# Altium schematic sheet 集成板.SchDoc
size A4; SheetNumber: 1; SheetTotal: 1
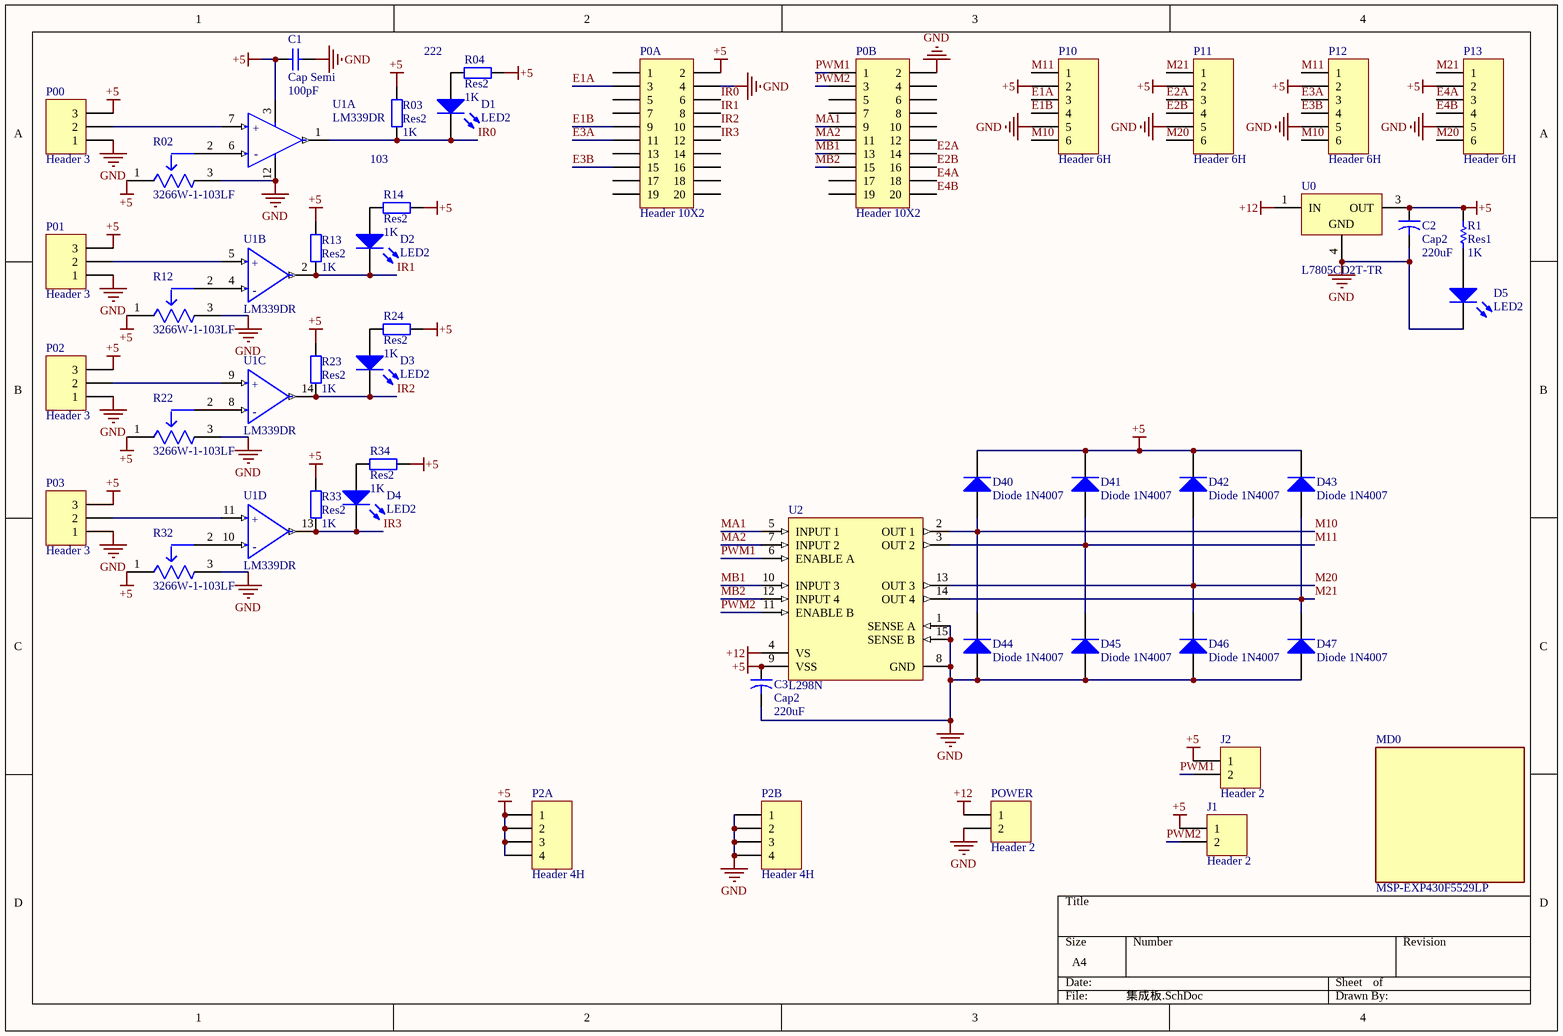
[diagram p0: 集成板.SchDoc]

## Parts
C1  Cap Semi  value 100pF  [C1206]
C2  Cap2  value 220uF  [CAPR5-4X5]
C3  Cap2  value 220uF  [CAPR5-4X5]
D1  LED2  [3.2X1.6X1.1]
D2  LED2  [3.2X1.6X1.1]
D3  LED2  [3.2X1.6X1.1]
D4  LED2  [3.2X1.6X1.1]
D5  LED2  [3.2X1.6X1.1]
D40  Diode 1N4007  [DO-41]
D41  Diode 1N4007  [DO-41]
D42  Diode 1N4007  [DO-41]
D43  Diode 1N4007  [DO-41]
D44  Diode 1N4007  [DO-41]
D45  Diode 1N4007  [DO-41]
D46  Diode 1N4007  [DO-41]
D47  Diode 1N4007  [DO-41]
J1  Header 2  [HDR1X2]
J2  Header 2  [HDR1X2]
MD0  MSP-EXP430F5529LP  [FP-MSP-EXP430F5529LP-MFG]
P00  Header 3  [HDR1X3]
P0A  Header 10X2  [HDR2X10]
P0B  Header 10X2  [HDR2X10]
P01  Header 3  [HDR1X3]
P02  Header 3  [HDR1X3]
P2A  Header 4H  [HDR1X4H]
P2B  Header 4H  [HDR1X4H]
P03  Header 3  [HDR1X3]
P10  Header 6H  [HDR1X6H]
P11  Header 6H  [HDR1X6H]
P12  Header 6H  [HDR1X6H]
P13  Header 6H  [HDR1X6H]
POWER  Header 2  [HDR1X2]
R1  Res1  value 1K  [AXIAL-0.3]
R02  3266W-1-103LF  [FP-3266W-MFG]
R03  Res2  value 1K  [C1206]
R04  Res2  value 1K  [C1206]
R12  3266W-1-103LF  [FP-3266W-MFG]
R13  Res2  value 1K  [C1206]
R14  Res2  value 1K  [C1206]
R22  3266W-1-103LF  [FP-3266W-MFG]
R23  Res2  value 1K  [C1206]
R24  Res2  value 1K  [C1206]
R32  3266W-1-103LF  [FP-3266W-MFG]
R33  Res2  value 1K  [C1206]
R34  Res2  value 1K  [C1206]
U0  L7805CD2T-TR  [TO-263_M]
U1  LM339DR  [FP-D0014A-MFG]  (parts A,B,C,D of 4)
U2  L298N  [STM-FM-15]

## Nets
+5: C1.1 C2.1 C3.1 D40.2(K) D41.2(K) D42.2(K) D43.2(K) J1.1 J2.1 P00.3 P0A.2 P01.3 P02.3 P2A.1 P2A.2 P2A.3 P2A.4 P03.3 P10.2 P11.2 P12.2 P13.2 R1.2 R02.1(CCW) R03.2 R04.1 R12.1(CCW) R13.2 R14.2 R22.1(CCW) R23.1 R24.2 R32.1(CCW) R33.2 R34.2 U0.3(OUT) U1.3(VCC) U2.9(VSS)
+12: POWER.1 U0.1(IN) U2.4(VS)
GND: C1.2 C2.2 C3.2 D5.2(K) D44.1(A) D45.1(A) D46.1(A) D47.1(A) P00.1 P0A.4 P0B.2 P01.1 P02.1 P2B.1 P2B.2 P2B.3 P2B.4 P03.1 P10.5 P11.5 P12.5 P13.5 POWER.2 R02.3(CW) R12.3(CW) R22.3(CW) R32.3(CW) U0.4(GND) U1.12(GND) U2.1(SENSE_A) U2.8(GND) U2.15(SENSE_B)
E1A: P0A.3 P10.3
E1B: P0A.9 P10.4
E2A: P0B.14 P11.3
E2B: P0B.16 P11.4
E3A: P0A.11 P12.3
E3B: P0A.15 P12.4
E4A: P0B.18 P13.3
E4B: P0B.20 P13.4
IR0: D1.2(K) P0A.6 R03.1 U1.1(1OUT)
IR1: D2.2(K) P0A.8 R13.1 U1.2(2OUT)
IR2: D3.2(K) P0A.10 R23.2 U1.14(OUT3)
IR3: D4.2(K) P0A.12 R33.1 U1.13(OUT4)
M10: D40.1(A) D44.2(K) P10.6 P12.6 U2.2(OUT_1)
M11: D41.1(A) D45.2(K) P10.1 P12.1 U2.3(OUT_2)
M20: D42.1(A) D46.2(K) P11.6 P13.6 U2.13(OUT_3)
M21: D43.1(A) D47.2(K) P11.1 P13.1 U2.14(OUT_4)
MA1: P0B.9 U2.5(INPUT_1)
MA2: P0B.11 U2.7(INPUT_2)
MB1: P0B.13 U2.10(INPUT_3)
MB2: P0B.15 U2.12(INPUT_4)
PWM1: J2.2 P0B.1 U2.6(ENABLE_A)
PWM2: J1.2 P0B.3 U2.11(ENABLE_B)
NetD1_1: D1.1(A) R04.2
NetD2_1: D2.1(A) R14.1
NetD3_1: D3.1(A) R24.1
NetD4_1: D4.1(A) R34.1
NetD5_1: D5.1(A) R1.1
NetP00_2: P00.2 U1.7(1IN+)
NetP01_2: P01.2 U1.5(2IN+)
NetP02_2: P02.2 U1.9(3IN+)
NetP03_2: P03.2 U1.11(4IN+)
NetR02_2: R02.2(WIPER) U1.6(1IN-)
NetR12_2: R12.2(WIPER) U1.4(2IN-)
NetR22_2: R22.2(WIPER) U1.8(3IN-)
NetR32_2: R32.2(WIPER) U1.10(4IN-)

Not connected (* = marked no-connect by the designer): P0A 1 5 7 13 14 16 17 18 19 20; P0B 4 5 6 7 8 10 12 17 19

## Notes on the sheet
- 222
- 103
- (in symbol CMP-04896-000028-1, part A) +; -
- (in symbol CMP-04896-000028-1, part B) +; -
- (in symbol CMP-04896-000028-1, part C) +; -
- (in symbol CMP-04896-000028-1, part D) +; -

## Library data of the parts
C1 = Cap Semi: Capacitor (Semiconductor SIM Model); Published: 8-Jun-2000; LatestRevisionDate: 29-May-2009; LatestRevisionNote: IPC-7351 Footprint Added.; PackageReference: C1206; Publisher: Altium Limited; PackageDescription: Chip Capacitor
C2 C3 = Cap2: Capacitor; Published: 23-Sep-2002; PackageReference: CAPR5-4X5; Publisher: Altium Limited; PackageDescription: Capacitor; 2 Leads
D1-D5 = LED2: Typical RED, GREEN, YELLOW, AMBER GaAs LED; Published: 8-Jun-2000; LatestRevisionDate: 17-Jul-2002; LatestRevisionNote: Re-released for DXP Platform.; PackageVersion: Feb-2002; PackageReference: 3.2X1.6X1.1; Publisher: Altium Limited; PackageDescription: SM LED; 2 Flat Leads
D40-D47 = Diode 1N4007: 1 Amp General Purpose Rectifier; Published: 8-Jun-2000; LatestRevisionDate: 17-Jul-2002; LatestRevisionNote: Re-released for DXP Platform.; DatasheetVersion: 1998; PackageVersion: Aug-1999; PackageReference: DO-41; Publisher: Altium Limited; PackageDescription: Diode, Axial; Body 5.2 x 2.7 mm (LxDia. max), Lead Dia. 0.86 mm (max); Code_JEDEC: DO-204-AL; ComponentLink1Description: Manufacturer Link; ComponentLink1URL: http://www.fairchildsemi.com/; ComponentLink2Description: Datasheet; ComponentLink2URL: http://www.fairchildsemi.com/ds/1N%2F1N4001.pdf
J1 J2 POWER = Header 2: Header, 2-Pin; LatestRevisionDate: 17-Jul-2002; LatestRevisionNote: Re-released for DXP Platform.; Publisher: Altium Limited
MD0 = CMP-04865-000002-1: LAUNCHPAD MSP430F5529 EVAL BRD; Manufacturer: Texas Instruments; Max Supply Voltage: 5V; Memory Size: 128KBytes; Memory Type: FLASH; Number Of I/Os: 35; Frequency: 25MHz; Min Supply Voltage: 3.3V; Digikey Description: LAUNCHPAD MSP430F5529 EVAL BRD; Package: 0; Device Class L1: Integrated Circuits (ICs); Device Class L3: unset; ComponentLink2URL: http://www.ti.com/lit/ug/slau533d/slau533d.pdf; Mouser Description: Development Boards & Kits - MSP430 MSP-EXP430F5529LP; Automotive: No; Manufacturer Part Number: MSP-EXP430F5529LP; Octopart: https://octopart.com/msp-exp430f5529lp-texas+instruments-30356695; Category: UNK; ComponentLink2Description: Datasheet; Lead Free: Yes; Device Class L2: Embedded Processors and Controllers
P00 P01 P02 P03 = Header 3: Header, 3-Pin; LatestRevisionDate: 17-Jul-2002; LatestRevisionNote: Re-released for DXP Platform.; Publisher: Altium Limited
P0A P0B = Header 10X2: Header, 10-Pin, Dual row; LatestRevisionDate: 17-Jul-2002; LatestRevisionNote: Re-released for DXP Platform.; Publisher: Altium Limited
P2A P2B = Header 4H: Header, 4-Pin, Right Angle; LatestRevisionDate: 17-Jul-2002; LatestRevisionNote: Re-released for DXP Platform.; Publisher: Altium Limited
P10-P13 = Header 6H: Header, 6-Pin, Right Angle; LatestRevisionDate: 17-Jul-2002; LatestRevisionNote: Re-released for DXP Platform.; Publisher: Altium Limited
R1 = Res1: Resistor; Published: 8-Jun-2000; LatestRevisionDate: 17-Jul-2002; LatestRevisionNote: Re-released for DXP Platform.; PackageReference: AXIAL-0.3; Publisher: Altium Limited; PackageDescription: Axial Device, Thru-Hole; 2 Leads; 0.3 in Pin Spacing
R02 R12 R22 R32 = CMP-07234-000016-1: TRIMMER 10K OHM 0.25W PC PIN TOP; Manufacturer: Bourns; Temperature Coefficient: 100ppm/°C; Tolerance: 10%; Value: 10kΩ; Standoff Height: 0.43mm; Device Class L3: Variable Resistors and Potentiometers; ComponentLink2URL: https://www.bourns.com/docs/Product-Datasheets/3266.pdf; ComponentLink2Description: Datasheet; Device Class L2: Resistors; Power Rating: 0.25W; Mouser Description: Trimmer Resistors - Through Hole 1/4 10Kohms 10% SQ W/Standoff Sealed; Category: Res; Digikey Description: TRIMMER 10K OHM 0.25W PC PIN TOP; Device Class L1: Passive Components; Octopart: https://octopart.com/3266w-1-103lf-bourns-81445; Height: 9.02mm; Temperature Range High: +125°C; Series: 3266; Temperature Range Low: -55°C; Composition: Cermet; Manufacturer Part Number: 3266W-1-103LF; Resistance: 10kΩ; Lead Free: Yes; RoHS: TRUE; Automotive: No; Package: 3266W; Temperature: -55°C to +125°C
R03 R04 R13 R14 R23 R24 R33 R34 = Res2: Resistor; Published: 8-Jun-2000; LatestRevisionDate: 17-Jul-2002; LatestRevisionNote: Re-released for DXP Platform.; PackageReference: AXIAL-0.4; Publisher: Altium Limited; PackageDescription: Axial Device, Thru-Hole; 2 Leads; 0.4 in Pin Spacing
U0 = CMP-0244-00213-1: Positive Voltage Regulator, 3-Pin D2PAK, Tape and Reel; PackageReference: TO-263; ComponentLink2URL: http://www.st.com/internet/com/TECHNICAL_RESOURCES/TECHNICAL_LITERATURE/DATASHEET/CD00000444.pdf; PackageDescription: 3-Pin Transistor Outline Package 2.54 mm Pitch, 15.4 mm Lead Span (D2PAK); DatasheetVersion: 16/11/2011; ComponentLink2Description: Datasheet; ComponentLink1Description: Manufacturer URL; PackageVersion: 2011; ComponentLink1URL: http://www.st.com
U1 = CMP-04896-000028-1: IC QUAD DIFF COMP 14-SOIC; Manufacturer: Texas Instruments; Nominal Supply Current: 0.8mA; Min Dual Supply Voltage: 1V; Number Of Channels: 4; Input Offset Voltage: 2mV; Max Junction Temp: +70°C; Min Supply Voltage: 2V; Response Time: 1.3us; Max Dual Supply Voltage: 18V; Max Supply Voltage: 30V; Standoff Height: 0.1mm; Input Bias Current: -0.025uA; Output Current Per Channel: 6mA; Category: IC; Octopart: https://octopart.com/lm339dr-texas+instruments-45532; Automotive: No; Temperature: 0°C to +70°C; Ipc Land Pattern Name: SOIC127P600X175-14; Temperature Range Low: 0°C; Mouser Description: Analog Comparators Quad Differential; Lead Free: Yes; Digikey Description: IC QUAD DIFF COMP 14-SOIC; ComponentLink2URL: http://www.ti.com/lit/ds/symlink/lm339.pdf; Device Class L3: Comparators; Manufacturer Part Number: LM339DR; Temperature Range High: +70°C; Device Class L2: Linear ICs; Height: 1.75mm; Device Class L1: Integrated Circuits (ICs); Package: D0014A; RoHS: TRUE; ComponentLink2Description: Datasheet
U2 = CMP-2000-06526-1: Dual Full-Bridge Driver, 4.8 to 46 V, -40 to 150 degC, 15-Pin FM (MW 15L), RoHS, Tube; Manufacturer: STMicroelectronics; PartNumber: L298; Output Current: 2A; Supply Voltage Max: 7V; Driver Case Style: Multiwatt; Supply Voltage Min: 4.5V; No. of Pins: 15Pins; SVHC: NoSVHC(17-Dec-2015); Output Voltage: 46V; No. of Outputs: 4Outputs; Motor Type: FullBridge; MSL: -; Package Description: 15-Pin Flange Mount, Body 5 x 19.6 mm, Pitch 1.27 mm; Datasheet Version: 01/2000; Package Reference: FM-15; Mounting Technology: ThroughHole; Packaging: Each; Automotive Qualification Standard: -; Product Range: -; Datasheet URL: https://datasheet.ciiva.com/15109/getdatasheetpartid-50682-15109332.pdf; Operating Temperature Max: 130°C; Operating Temperature Min: -25°C; Manufacturer URL: http://www.st.com/